# Altium schematic sheet clock-temp-touch.SchDoc
size A3; SPICEModelCacheRLVYLVLF: <root> / <DocumentId>RLVYLVLF</DocumentId> / <CacheFrame Number="0"> / <Model Name="qnpn" Kind="MDL"> / <Text>*QNPN / *NPN Trans Pinout: C,B,E / .MODEL QNPN NPN(IS=3.2E-16 BF=141 VAF=35 ISE=2.6 NE=1.46 CJE=1E-13 / + MJE=0.333 TF=6E-11 CJC=1E-13 CJS=2.2E-13 MJS=0.5 FC=0.67 )</Text> / </Model> / <Model Name="dtunnel1" Kind="CKT"> / <Text>*Tunnel Diode Default / *MCE 600V 50A 27.2ns default parameters / *Diode Pinout: A,K / * Parameters: / * RS:  Series resistance value / * RP:  Negative resistance value in parallel with capacitance. / * CP:   Capacitance value in parallel with negative resistance. / * LS:  Series inductance value. / * / * / .SUBCKT DTUNNEL1 1 2 PARAMS: Rs=6 Rp=-75 Cp=0.6E-12 Ls=0.1nH / RS  1 3  {Rs} / RP  3 4  {Rp} / CP  3 4  {Cp} / LS  4 2  {Ls} / .ENDS DTUNNEL1</Text> / </Model> / </CacheFrame> / </root>
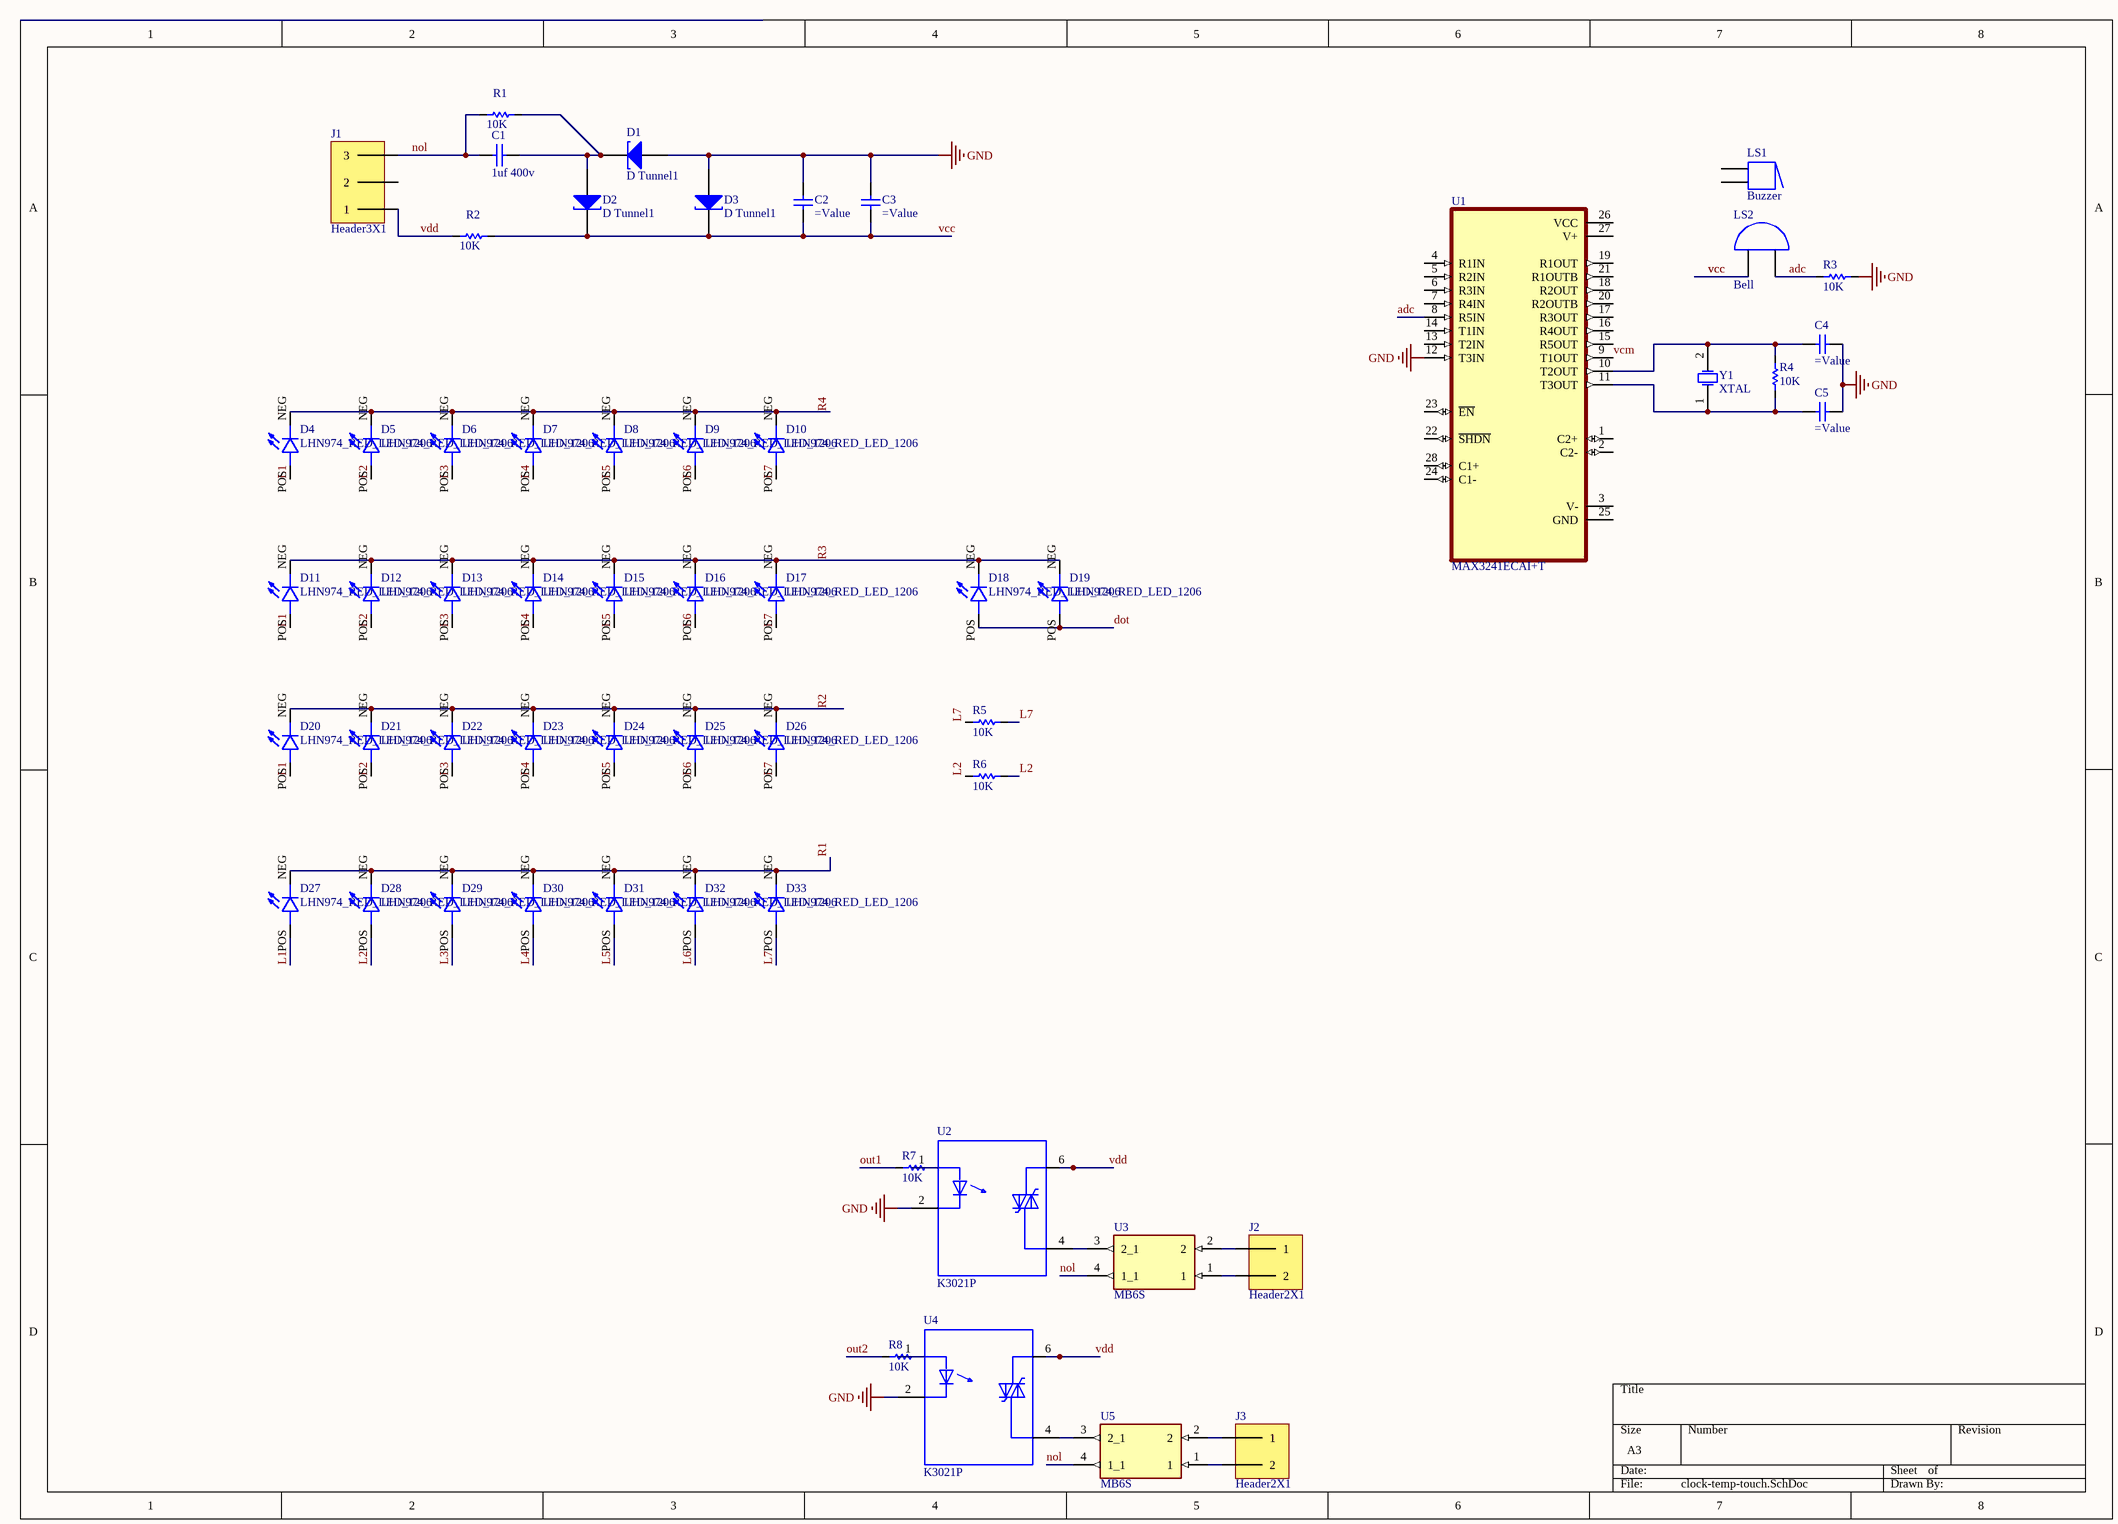
[diagram p0: clock-temp-touch.SchDoc]

## Parts
C1  1uf 400v  [1uf 400v]
C2  (no value)  [CAP 1206]
C3  (no value)  [CAP 1206]
C4  (no value)  [CAP 1206]
C5  (no value)  [CAP 1206]
D1  D Tunnel1  [3.2X1.6X1.1]
D2  D Tunnel1  [3.2X1.6X1.1]
D3  D Tunnel1  [3.2X1.6X1.1]
D4  LHN974_RED_LED_1206  [LEDC3216X120N]
D5  LHN974_RED_LED_1206  [LEDC3216X120N]
D6  LHN974_RED_LED_1206  [LEDC3216X120N]
D7  LHN974_RED_LED_1206  [LEDC3216X120N]
D8  LHN974_RED_LED_1206  [LEDC3216X120N]
D9  LHN974_RED_LED_1206  [LEDC3216X120N]
D10  LHN974_RED_LED_1206  [LEDC3216X120N]
D11  LHN974_RED_LED_1206  [LEDC3216X120N]
D12  LHN974_RED_LED_1206  [LEDC3216X120N]
D13  LHN974_RED_LED_1206  [LEDC3216X120N]
D14  LHN974_RED_LED_1206  [LEDC3216X120N]
D15  LHN974_RED_LED_1206  [LEDC3216X120N]
D16  LHN974_RED_LED_1206  [LEDC3216X120N]
D17  LHN974_RED_LED_1206  [LEDC3216X120N]
D18  LHN974_RED_LED_1206  [LEDC3216X120N]
D19  LHN974_RED_LED_1206  [LEDC3216X120N]
D20  LHN974_RED_LED_1206  [LEDC3216X120N]
D21  LHN974_RED_LED_1206  [LEDC3216X120N]
D22  LHN974_RED_LED_1206  [LEDC3216X120N]
D23  LHN974_RED_LED_1206  [LEDC3216X120N]
D24  LHN974_RED_LED_1206  [LEDC3216X120N]
D25  LHN974_RED_LED_1206  [LEDC3216X120N]
D26  LHN974_RED_LED_1206  [LEDC3216X120N]
D27  LHN974_RED_LED_1206  [LEDC3216X120N]
D28  LHN974_RED_LED_1206  [LEDC3216X120N]
D29  LHN974_RED_LED_1206  [LEDC3216X120N]
D30  LHN974_RED_LED_1206  [LEDC3216X120N]
D31  LHN974_RED_LED_1206  [LEDC3216X120N]
D32  LHN974_RED_LED_1206  [LEDC3216X120N]
D33  LHN974_RED_LED_1206  [LEDC3216X120N]
J1  Header3X1  [HEADER 3X1]
J2  Header2X1  [Header 2X1]
J3  Header2X1  [Header 2X1]
LS1  Buzzer  [ABSM-1574]
LS2  Bell  [PIN2]
R1  10K  [RES 1206 (3216X08L)]
R2  10K  [Res-(2/1)]
R3  10K  [RES 1206 (3216X08L)]
R4  10K  [RES 1206 (3216X08L)]
R5  10K  [RES 1206 (3216X08L)]
R6  10K  [RES 1206 (3216X08L)]
R7  10K  [RES 1206 (3216X08L)]
R8  10K  [RES 1206 (3216X08L)]
U1  MAX3241ECAI+T  [SOP65P777X199-28N]
U2  K3021P  [DIP762W50P254L730H410Q6]
U3  MB6S  [SOIC245P670X270-4N]
U4  K3021P  [DIP762W50P254L730H410Q6]
U5  MB6S  [SOIC245P670X270-4N]
Y1  XTAL  [R38]

## Nets
GND: C2.2(-) C3.2(-) C4.1(+) C5.1(+) D1.1(A) D3.1(A) R3.1 U1.12(T3IN) U2.2(C) U4.2(C)
adc: LS2.2(B) R3.2 U1.8(R5IN)
dot: D18.POS D19.POS
L1: D4.POS D11.POS D20.POS D27.POS
L2: D5.POS D12.POS D21.POS D28.POS R6.1 R6.2
L3: D6.POS D13.POS D22.POS D29.POS
L4: D7.POS D14.POS D23.POS D30.POS
L5: D8.POS D15.POS D24.POS D31.POS
L6: D9.POS D16.POS D25.POS D32.POS
L7: D10.POS D17.POS D26.POS D33.POS R5.1 R5.2
nol: C1.1 J1.3 R1.1 U3.4(1_1) U5.4(1_1)
out1: R7.2
out2: R8.2
R1: D27.NEG D28.NEG D29.NEG D30.NEG D31.NEG D32.NEG D33.NEG
R2: D20.NEG D21.NEG D22.NEG D23.NEG D24.NEG D25.NEG D26.NEG
R3: D11.NEG D12.NEG D13.NEG D14.NEG D15.NEG D16.NEG D17.NEG D18.NEG D19.NEG
R4: D4.NEG D5.NEG D6.NEG D7.NEG D8.NEG D9.NEG D10.NEG
vcc: C2.1(+) C3.1(+) D2.2(K) D3.2(K) LS2.1(A) R2.2
vcm: U1.9(T1OUT)
vdd: J1.1 R2.1 U2.6(MT2) U4.6(MT2)
NetC1_2: C1.2 D1.2(K) D2.1(A) R1.2
NetC4_2: C4.2(-) R4.2 U1.10(T2OUT) Y1.2(OSC2)
NetC5_2: C5.2(-) R4.1 U1.11(T3OUT) Y1.1(OSC1)
NetJ2_1: J2.1 U3.2
NetJ2_2: J2.2 U3.1
NetJ3_1: J3.1 U5.2
NetJ3_2: J3.2 U5.1
NetLS1_1: LS1.1 LS1.1A
NetLS1_2: LS1.2 LS1.2A
NetR7_1: R7.1 U2.1(A)
NetR8_1: R8.1 U4.1(A)
NetU2_4: U2.4(MT1) U3.3(2_1)
NetU4_4: U4.4(MT1) U5.3(2_1)

Not connected (* = marked no-connect by the designer): J1 2; U1 1(C2+) 2(C2-) 3(V-) 4(R1IN) 5(R2IN) 6(R3IN) 7(R4IN) 13(T2IN) 14(T1IN) 15(R5OUT) 16(R4OUT) 17(R3OUT) 18(R2OUT) 19(R1OUT) 20(R2OUTB) 21(R1OUTB) 22(~{SHDN}) 23(~{EN}) 24(C1-) 25(GND) 26(VCC) 27(V+) 28(C1+)

## Library data of the parts
C1 = 1uf 400v: Capacitor 24*9mm; Designer: Seyed Mohsen Ghasemain; Value: 1uF; ComponentLinkURL: www.picpars.com
C2-C5 = Capacitor
D1-D3 = D Tunnel1: Tunnel Diode - RLC Model; Published: 8-Jun-2000; LatestRevisionDate: 17-Jul-2002; LatestRevisionNote: Re-released for DXP Platform.; PackageVersion: Feb-2002; PackageReference: 3.2X1.6X1.1; Publisher: Altium Limited; PackageDescription: SM LED; 2 Flat Leads
D4-D33 = LHN974_RED_LED_1206: 2.6 V Red LED SMD; MP: LHN974 RED LED 1206; MF: Osram; SnapEDA_Link: https://www.snapeda.com/parts/LHN974%20RED%20LED%201206/Osram/view-part/7899607/?ref=snap; Availability: Not in stock; Price: None; Check_prices: https://www.snapeda.com/parts/LHN974%20RED%20LED%201206/Osram/view-part/7899607/?ref=eda; Value: *; Package: None
LS1 = Buzzer: Magnetic Transducer Buzzer; Published: 24-Mar-1999; LatestRevisionDate: 17-Dec-2003; LatestRevisionNote: Schematic revised, PCB Footprint replaced.; DatasheetVersion: 17-Dec-2003; PackageReference: ABSM-1574; Publisher: Altium Limited; PackageDescription: Magnetic Transducer Buzzer; ComponentLink1Description: Manufacturer Link; ComponentLink1URL: http://www.megastar.com/linecard/buzzmode/index.php
LS2 = Bell: Electrical Bell; Published: 24-Mar-1999; LatestRevisionDate: 17-Jul-2002; LatestRevisionNote: Re-released for DXP Platform.; PackageReference: PIN2; Publisher: Altium Limited
R1-R8 = Resistor: Tolerance: 5%; Power: 1/4 W; Value: 10K
U1 = MAX3241ECAI+T: ±15kV ESD-Protected, Down to 10nA, 3.0V to 5.5V, Up to 1Mbps, True RS-232 Transceivers; MF: Analog Devices; SnapEDA_Link: https://www.snapeda.com/parts/MAX3241ECAI+T/Analog+Devices/view-part/?ref=snap; Package: SSOP-28 Maxim; Value: *; MP: MAX3241ECAI+T; Check_prices: https://www.snapeda.com/parts/MAX3241ECAI+T/Analog+Devices/view-part/?ref=eda
U2 U4 = K3021P: Optoisolator Triac Output 5300Vrms 1 Channel 6-DIP; MF: Vishay Semiconductor; Package: DIP-6 Vishay; Availability: Unavailable; Value: *; MP: K3021P; Mouser-Purchase-URL: https://snapeda.com/shop?store=Mouser&id=291595; SnapEDA_Link: https://www.snapeda.com/parts/K3021P/Vishay%20Semiconductor%20Opto%20Division/view-part/291595/?ref=snap; Price: None; DigiKey-Purchase-URL: https://snapeda.com/shop?store=DigiKey&id=291595
U3 U5 = MB6S: Bridge Rectifier Single Phase Standard 600V Surface Mount 4-SOIC; MF: ON Semiconductor; Digi-Key_Purchase_URL: https://www.digikey.com.tr/product-detail/en/on-semiconductor/MB6S/MB6SCT-ND/965654?utm_source=snapeda&utm_medium=aggregator&utm_campaign=symbol; Value: *; Package: BESOP-4 Surge Components; Digi-Key_Part_Number: MB6SCT-ND; SnapEDA_Link: https://www.snapeda.com/parts/MB6S/ON%20Semiconductor/view-part/2774209/?ref=snap; MP: MB6S
Y1 = XTAL: Crystal Oscillator; Published: 8-Jun-2000; LatestRevisionDate: 17-Jul-2002; LatestRevisionNote: Re-released for DXP Platform.; PackageReference: R38; Publisher: Altium Limited; PackageDescription: Crystal, Thru-Hole; 2 Leads; Body 3.1 x 8.2 mm (Dia.xH)